# EAGLE design wordclock-ledboard (EAGLE 6.4)
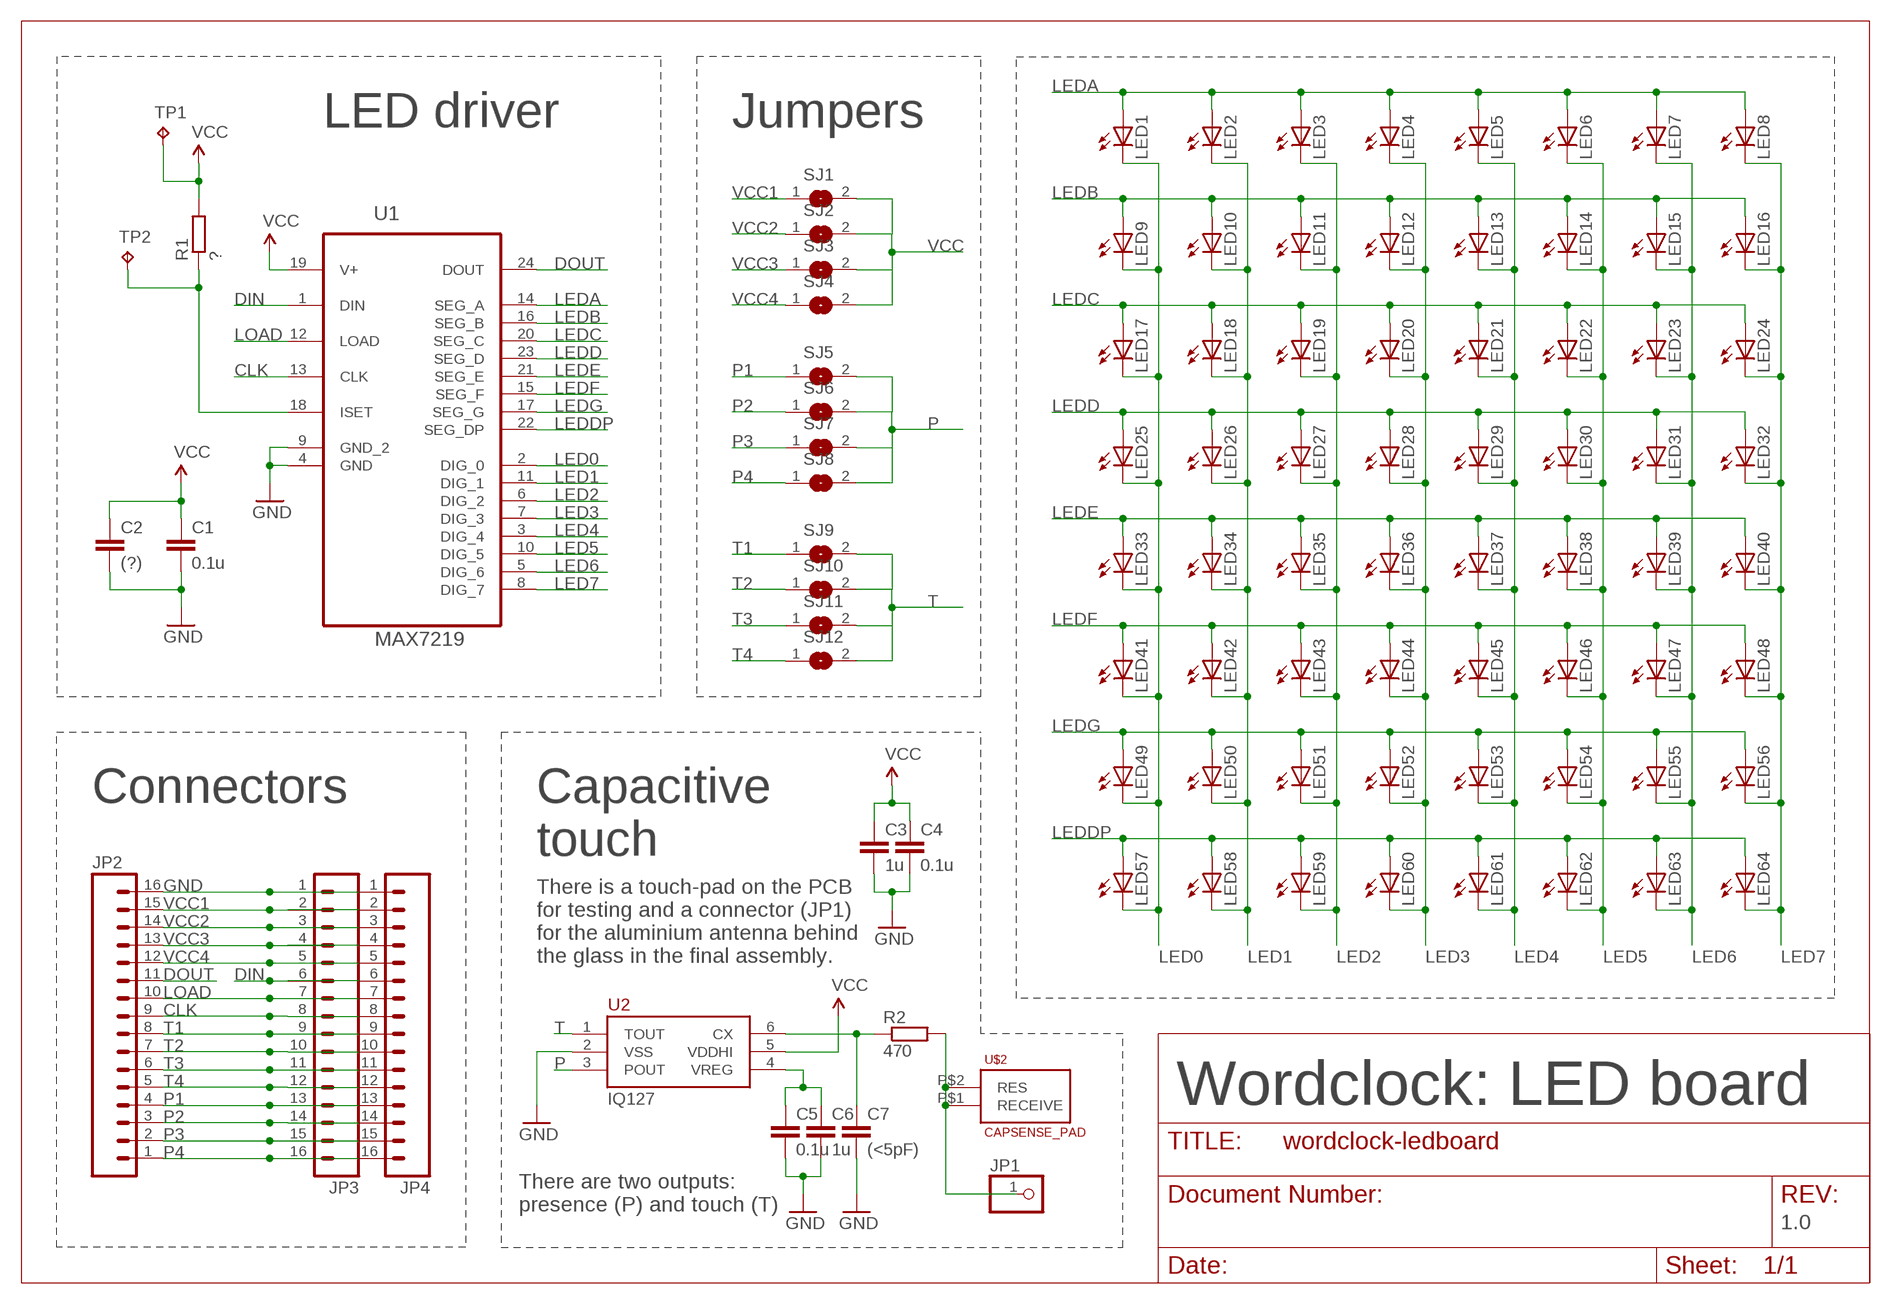
[diagram p0: schematic, sheet 1]

## Parts
C1  0.1u  C-EUC0805  [C0805]
C2  (?)  C-EUC0805  [C0805]
C3  1u  C-EUC0805  [C0805]
C4  0.1u  C-EUC0805  [C0805]
C5  0.1u  C-EUC0805  [C0805]
C6  1u  C-EUC0805  [C0805]
C7  (<5pF)  C-EUC0805  [C0805]
JP1  PINHD-1X1  [1X01]
JP2  M161X16_NO_SILK  [1X16_NO_SILK]
JP3  M161X16_NO_SILK  [1X16_NO_SILK]
JP4  M161X16_NO_SILK  [1X16_NO_SILK]
LED1  LEDKA-3528ASYC  [KA-3528ASYC]
LED2  LEDKA-3528ASYC  [KA-3528ASYC]
LED3  LEDKA-3528ASYC  [KA-3528ASYC]
LED4  LEDKA-3528ASYC  [KA-3528ASYC]
LED5  LEDKA-3528ASYC  [KA-3528ASYC]
LED6  LEDKA-3528ASYC  [KA-3528ASYC]
LED7  LEDKA-3528ASYC  [KA-3528ASYC]
LED8  LEDKA-3528ASYC  [KA-3528ASYC]
LED9  LEDKA-3528ASYC  [KA-3528ASYC]
LED10  LEDKA-3528ASYC  [KA-3528ASYC]
LED11  LEDKA-3528ASYC  [KA-3528ASYC]
LED12  LEDKA-3528ASYC  [KA-3528ASYC]
LED13  LEDKA-3528ASYC  [KA-3528ASYC]
LED14  LEDKA-3528ASYC  [KA-3528ASYC]
LED15  LEDKA-3528ASYC  [KA-3528ASYC]
LED16  LEDKA-3528ASYC  [KA-3528ASYC]
LED17  LEDKA-3528ASYC  [KA-3528ASYC]
LED18  LEDKA-3528ASYC  [KA-3528ASYC]
LED19  LEDKA-3528ASYC  [KA-3528ASYC]
LED20  LEDKA-3528ASYC  [KA-3528ASYC]
LED21  LEDKA-3528ASYC  [KA-3528ASYC]
LED22  LEDKA-3528ASYC  [KA-3528ASYC]
LED23  LEDKA-3528ASYC  [KA-3528ASYC]
LED24  LEDKA-3528ASYC  [KA-3528ASYC]
LED25  LEDKA-3528ASYC  [KA-3528ASYC]
LED26  LEDKA-3528ASYC  [KA-3528ASYC]
LED27  LEDKA-3528ASYC  [KA-3528ASYC]
LED28  LEDKA-3528ASYC  [KA-3528ASYC]
LED29  LEDKA-3528ASYC  [KA-3528ASYC]
LED30  LEDKA-3528ASYC  [KA-3528ASYC]
LED31  LEDKA-3528ASYC  [KA-3528ASYC]
LED32  LEDKA-3528ASYC  [KA-3528ASYC]
LED33  LEDKA-3528ASYC  [KA-3528ASYC]
LED34  LEDKA-3528ASYC  [KA-3528ASYC]
LED35  LEDKA-3528ASYC  [KA-3528ASYC]
LED36  LEDKA-3528ASYC  [KA-3528ASYC]
LED37  LEDKA-3528ASYC  [KA-3528ASYC]
LED38  LEDKA-3528ASYC  [KA-3528ASYC]
LED39  LEDKA-3528ASYC  [KA-3528ASYC]
LED40  LEDKA-3528ASYC  [KA-3528ASYC]
LED41  LEDKA-3528ASYC  [KA-3528ASYC]
LED42  LEDKA-3528ASYC  [KA-3528ASYC]
LED43  LEDKA-3528ASYC  [KA-3528ASYC]
LED44  LEDKA-3528ASYC  [KA-3528ASYC]
LED45  LEDKA-3528ASYC  [KA-3528ASYC]
LED46  LEDKA-3528ASYC  [KA-3528ASYC]
LED47  LEDKA-3528ASYC  [KA-3528ASYC]
LED48  LEDKA-3528ASYC  [KA-3528ASYC]
LED49  LEDKA-3528ASYC  [KA-3528ASYC]
LED50  LEDKA-3528ASYC  [KA-3528ASYC]
LED51  LEDKA-3528ASYC  [KA-3528ASYC]
LED52  LEDKA-3528ASYC  [KA-3528ASYC]
LED53  LEDKA-3528ASYC  [KA-3528ASYC]
LED54  LEDKA-3528ASYC  [KA-3528ASYC]
LED55  LEDKA-3528ASYC  [KA-3528ASYC]
LED56  LEDKA-3528ASYC  [KA-3528ASYC]
LED57  LEDKA-3528ASYC  [KA-3528ASYC]
LED58  LEDKA-3528ASYC  [KA-3528ASYC]
LED59  LEDKA-3528ASYC  [KA-3528ASYC]
LED60  LEDKA-3528ASYC  [KA-3528ASYC]
LED61  LEDKA-3528ASYC  [KA-3528ASYC]
LED62  LEDKA-3528ASYC  [KA-3528ASYC]
LED63  LEDKA-3528ASYC  [KA-3528ASYC]
LED64  LEDKA-3528ASYC  [KA-3528ASYC]
R1  ?  R-EU_R0603  [R0603]
R2  470  R-EU_R0603  [R0603]
SJ1  SJW  [SJW]
SJ2  SJW  [SJW]
SJ3  SJW  [SJW]
SJ4  SJW  [SJW]
SJ5  SJW  [SJW]
SJ6  SJW  [SJW]
SJ7  SJW  [SJW]
SJ8  SJW  [SJW]
SJ9  SJW  [SJW]
SJ10  SJW  [SJW]
SJ11  SJW  [SJW]
SJ12  SJW  [SJW]
TP1  TPTP20R  [TP20R]
TP2  TPTP20R  [TP20R]
U1  MAX7219  MAX7219CWG+T  [SOIC127P1032X265-24N]
U2  IQ127  [TSOT-23-6]
U$2  CAPSENSE_PAD  [CAPSENSE_PAD]

## Nets
C6: C5.1 C6.1 U2.4(VREG)
CLK: JP2.9 JP3.8 JP4.8 U1.13(CLK)
DIN: JP3.6 JP4.6 U1.1(DIN)
DOUT: JP2.11 U1.24(DOUT)
GND: C1.2 C2.2 C3.2 C4.2 C5.2 C6.2 C7.2 JP2.16 JP3.1 JP4.1 U1.4(GND) U1.9(GND_2) U2.2(VSS)
LED0: LED1.C LED9.C LED17.C LED25.C LED33.C LED41.C LED49.C LED57.C U1.2(DIG_0)
LED1: LED2.C LED10.C LED18.C LED26.C LED34.C LED42.C LED50.C LED58.C U1.11(DIG_1)
LED2: LED3.C LED11.C LED19.C LED27.C LED35.C LED43.C LED51.C LED59.C U1.6(DIG_2)
LED3: LED4.C LED12.C LED20.C LED28.C LED36.C LED44.C LED52.C LED60.C U1.7(DIG_3)
LED4: LED5.C LED13.C LED21.C LED29.C LED37.C LED45.C LED53.C LED61.C U1.3(DIG_4)
LED5: LED6.C LED14.C LED22.C LED30.C LED38.C LED46.C LED54.C LED62.C U1.10(DIG_5)
LED6: LED7.C LED15.C LED23.C LED31.C LED39.C LED47.C LED55.C LED63.C U1.5(DIG_6)
LED7: LED8.C LED16.C LED24.C LED32.C LED40.C LED48.C LED56.C LED64.C U1.8(DIG_7)
LEDA: LED1.A LED2.A LED3.A LED4.A LED5.A LED6.A LED7.A LED8.A U1.14(SEG_A)
LEDB: LED9.A LED10.A LED11.A LED12.A LED13.A LED14.A LED15.A LED16.A U1.16(SEG_B)
LEDC: LED17.A LED18.A LED19.A LED20.A LED21.A LED22.A LED23.A LED24.A U1.20(SEG_C)
LEDD: LED25.A LED26.A LED27.A LED28.A LED29.A LED30.A LED31.A LED32.A U1.23(SEG_D)
LEDDP: LED57.A LED58.A LED59.A LED60.A LED61.A LED62.A LED63.A LED64.A U1.22(SEG_DP)
LEDE: LED33.A LED34.A LED35.A LED36.A LED37.A LED38.A LED39.A LED40.A U1.21(SEG_E)
LEDF: LED41.A LED42.A LED43.A LED44.A LED45.A LED46.A LED47.A LED48.A U1.15(SEG_F)
LEDG: LED49.A LED50.A LED51.A LED52.A LED53.A LED54.A LED55.A LED56.A U1.17(SEG_G)
LOAD: JP2.10 JP3.7 JP4.7 U1.12(LOAD)
N$3: JP1.1 R2.2 U$2.P$1(RECEIVE) U$2.P$2(RES)
N$7: R1.1 TP2.TP U1.18(ISET)
N$13: C7.1 R2.1 U2.6(CX)
P: SJ5.2 SJ6.2 SJ7.2 SJ8.2 U2.3(POUT)
P1: JP2.4 JP3.13 JP4.13 SJ5.1
P2: JP2.3 JP3.14 JP4.14 SJ6.1
P3: JP2.2 JP3.15 JP4.15 SJ7.1
P4: JP2.1 JP3.16 JP4.16 SJ8.1
T: SJ9.2 SJ10.2 SJ11.2 SJ12.2 U2.1(TOUT)
T1: JP2.8 JP3.9 JP4.9 SJ9.1
T2: JP2.7 JP3.10 JP4.10 SJ10.1
T3: JP2.6 JP3.11 JP4.11 SJ11.1
T4: JP2.5 JP3.12 JP4.12 SJ12.1
VCC: C1.1 C2.1 C3.1 C4.1 R1.2 SJ1.2 SJ2.2 SJ3.2 SJ4.2 TP1.TP U1.19(V+) U2.5(VDDHI)
VCC1: JP2.15 JP3.2 JP4.2 SJ1.1
VCC2: JP2.14 JP3.3 JP4.3 SJ2.1
VCC3: JP2.13 JP3.4 JP4.4 SJ3.1
VCC4: JP2.12 JP3.5 JP4.5 SJ4.1

## Notes on the sheet
- LED driver | Jumpers
- Connectors
- Capacitive
  touch
- There is a touch-pad on the PCB 
  for testing and a connector (JP1) 
  for the aluminium antenna behind 
  the glass in the final assembly.
- IQ127 | Wordclock: LED board
- There are two outputs: 
  presence (P) and touch (T)
- 1.0

## Library data of the parts
C1-C7 = rcl:C-EU: CAPACITOR, European symbol
JP1 = pinhead:PINHD-1X1: PIN HEADER
JP2-JP4 = SparkFun-Connectors:M16: 1x16 .1" header
LED1-LED64 = led:LED: LED OSRAM: - CHIPLED LG R971, LG N971, LY N971, LG Q971, LY Q971, LO R971, LY R971 LH N974, LH R974 LS Q976, LO Q976, LY Q976 LO Q996 - Hyper CHIPLED LW Q18S LB Q993, LB Q99A, LB R99A - SideLED LS A670, LO A670, LY A670, LG A670, LP A670 LB A673, LV A673, LT A673, LW A673 LH A674 LY A675 LS A676, LA A676, LO A676, LY A676, LW A676 LS A679, LY A679, LG A679 - Hyper Micro SIDELED® LS Y876, LA Y876, LO Y876, LY Y876 LT Y87S - SmartLED LW L88C, LW L88S LB L89C, LB L89S, LG L890 LS L89K, LO L89K, LY L89K LS L896, LA L896, LO L896, LY L896 - TOPLED LS T670, LO T670, LY T670, LG T670, LP T670 LSG T670, LSP T670, LSY T670, LOP T670, LYG T670 LG T671, LOG T671, LSG T671 LB T673, LV T673, LT T673, LW T673 LH T674 LS T676, LA T676, LO T676, LY T676, LB T676, LH T676, LSB T676, LW T676 LB T67C, LV T67C, LT T67C, LS T67K, LO T67K, LY T67K, LW E67C LS E67B, LA E67B, LO E67B, LY E67B, LB E67C, LV E67C, LT E67C LW T67C LS T679, LY T679, LG T679 LS T770, LO T770, LY T770, LG T770, LP T770 LB T773, LV T773, LT T773, LW T773 LH T774 LS E675, LA E675, LY E675, LS T675 LS T776, LA T776, LO T776, LY T776, LB T776 LHGB T686 LT T68C, LB T68C - Hyper Mini TOPLED® LB M676 - Mini TOPLED Santana® LG M470 LS M47K, LO M47K, LY M47K Source: http://www.osram.convergy.de LUXEON: - LUMILED® LXK2-PW12-R00, LXK2-PW12-S00, LXK2-PW14-U00, LXK2-PW14-V00 LXK2-PM12-R00, LXK2-PM12-S00, LXK2-PM14-U00 LXK2-PE12-Q00, LXK2-PE12-R00, LXK2-PE12-S00, LXK2-PE14-T00, LXK2-PE14-U00 LXK2-PB12-K00, LXK2-PB12-L00, LXK2-PB12-M00, LXK2-PB14-N00, LXK2-PB14-P00, LXK2-PB14-Q00 LXK2-PR12-L00, LXK2-PR12-M00, LXK2-PR14-Q00, LXK2-PR14-R00 LXK2-PD12-Q00, LXK2-PD12-R00, LXK2-PD12-S00 LXK2-PH12-R00, LXK2-PH12-S00 LXK2-PL12-P00, LXK2-PL12-Q00, LXK2-PL12-R00 Source: www.luxeon.com KINGBRIGHT: KA-3528ASYC Source: www.kingbright.com
R1 R2 = rcl:R-EU_: RESISTOR, European symbol
SJ1-SJ12 = jumper:SJ: SMD solder JUMPER
TP1 TP2 = testpad:TP: Test pad
U1 = Max7219Cwg:MAX7219CWG+T; DESCRIPTION: Serially Interfaced, 8-Digit LED Display Drivers; MPN: MAX7219CWG+T; OC_FARNELL: -; OC_NEWARK: 68K9462; PACKAGE: SOIC-24; SUPPLIER: Maxim
U2 = Wouter-Azoteq:IQ127
U$2 = SparkFun-Electromechanical:CAPSENSE_PAD: Generic copper pad for a capacitive touch sensor.

## Board
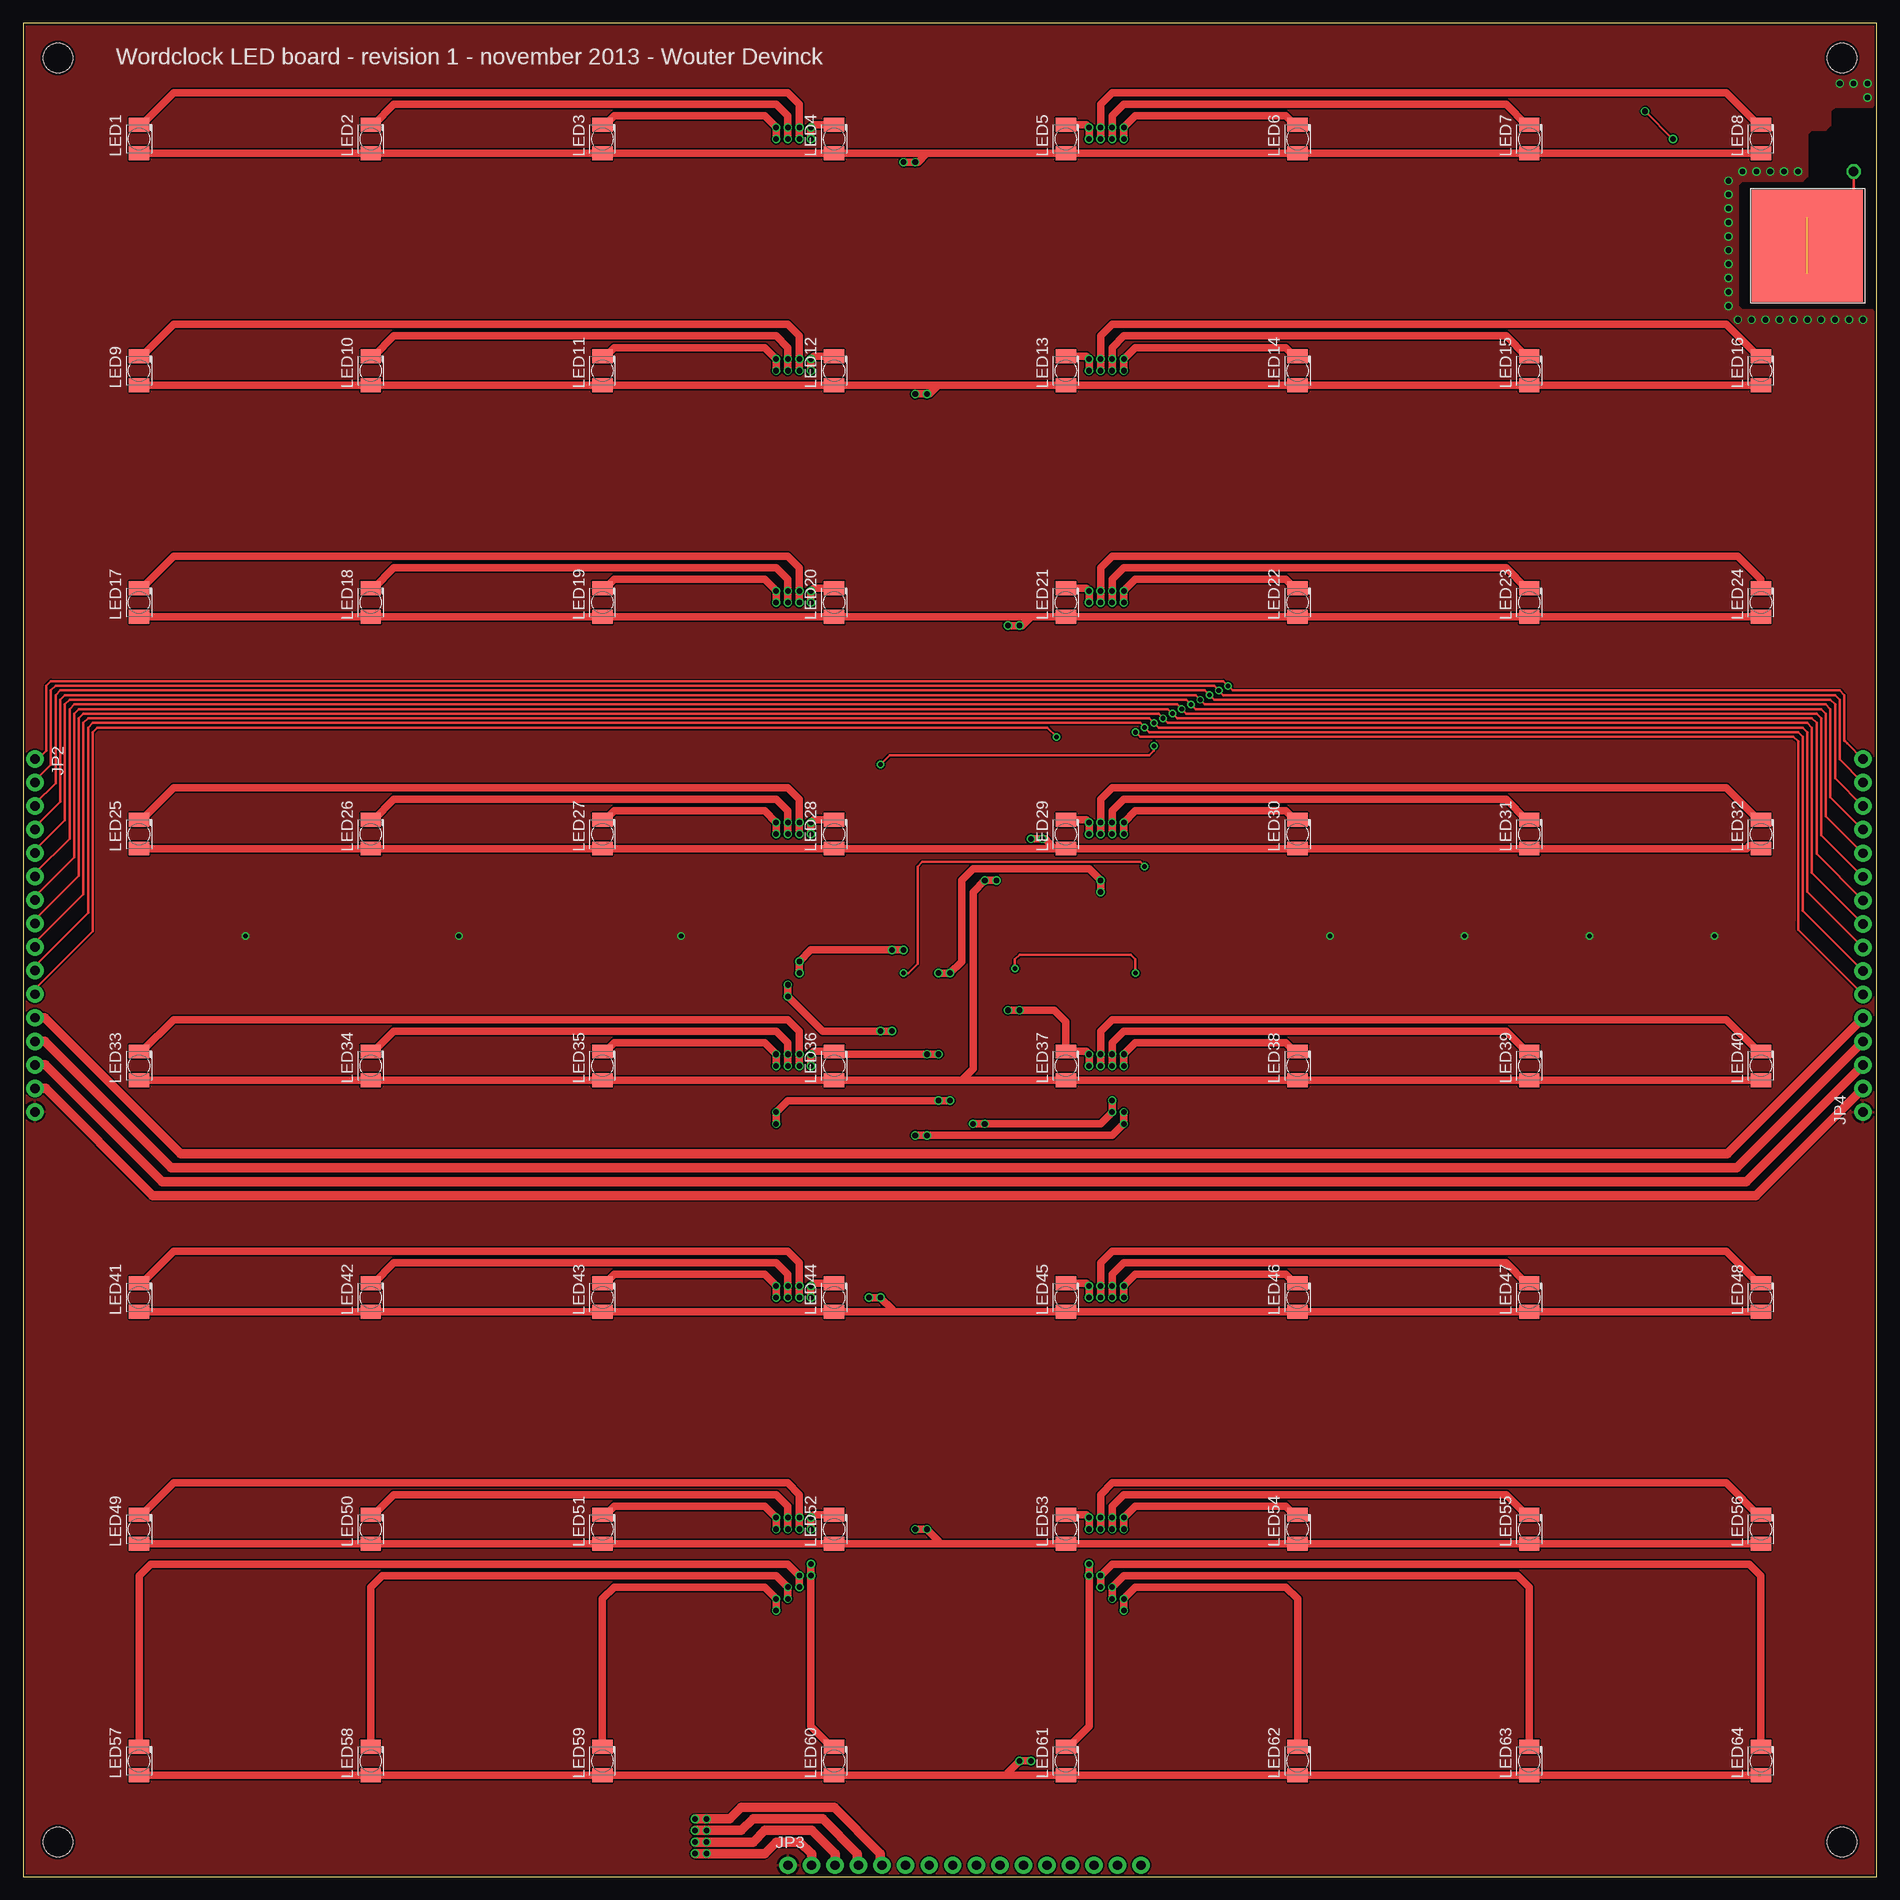
[diagram p1: board, top side]
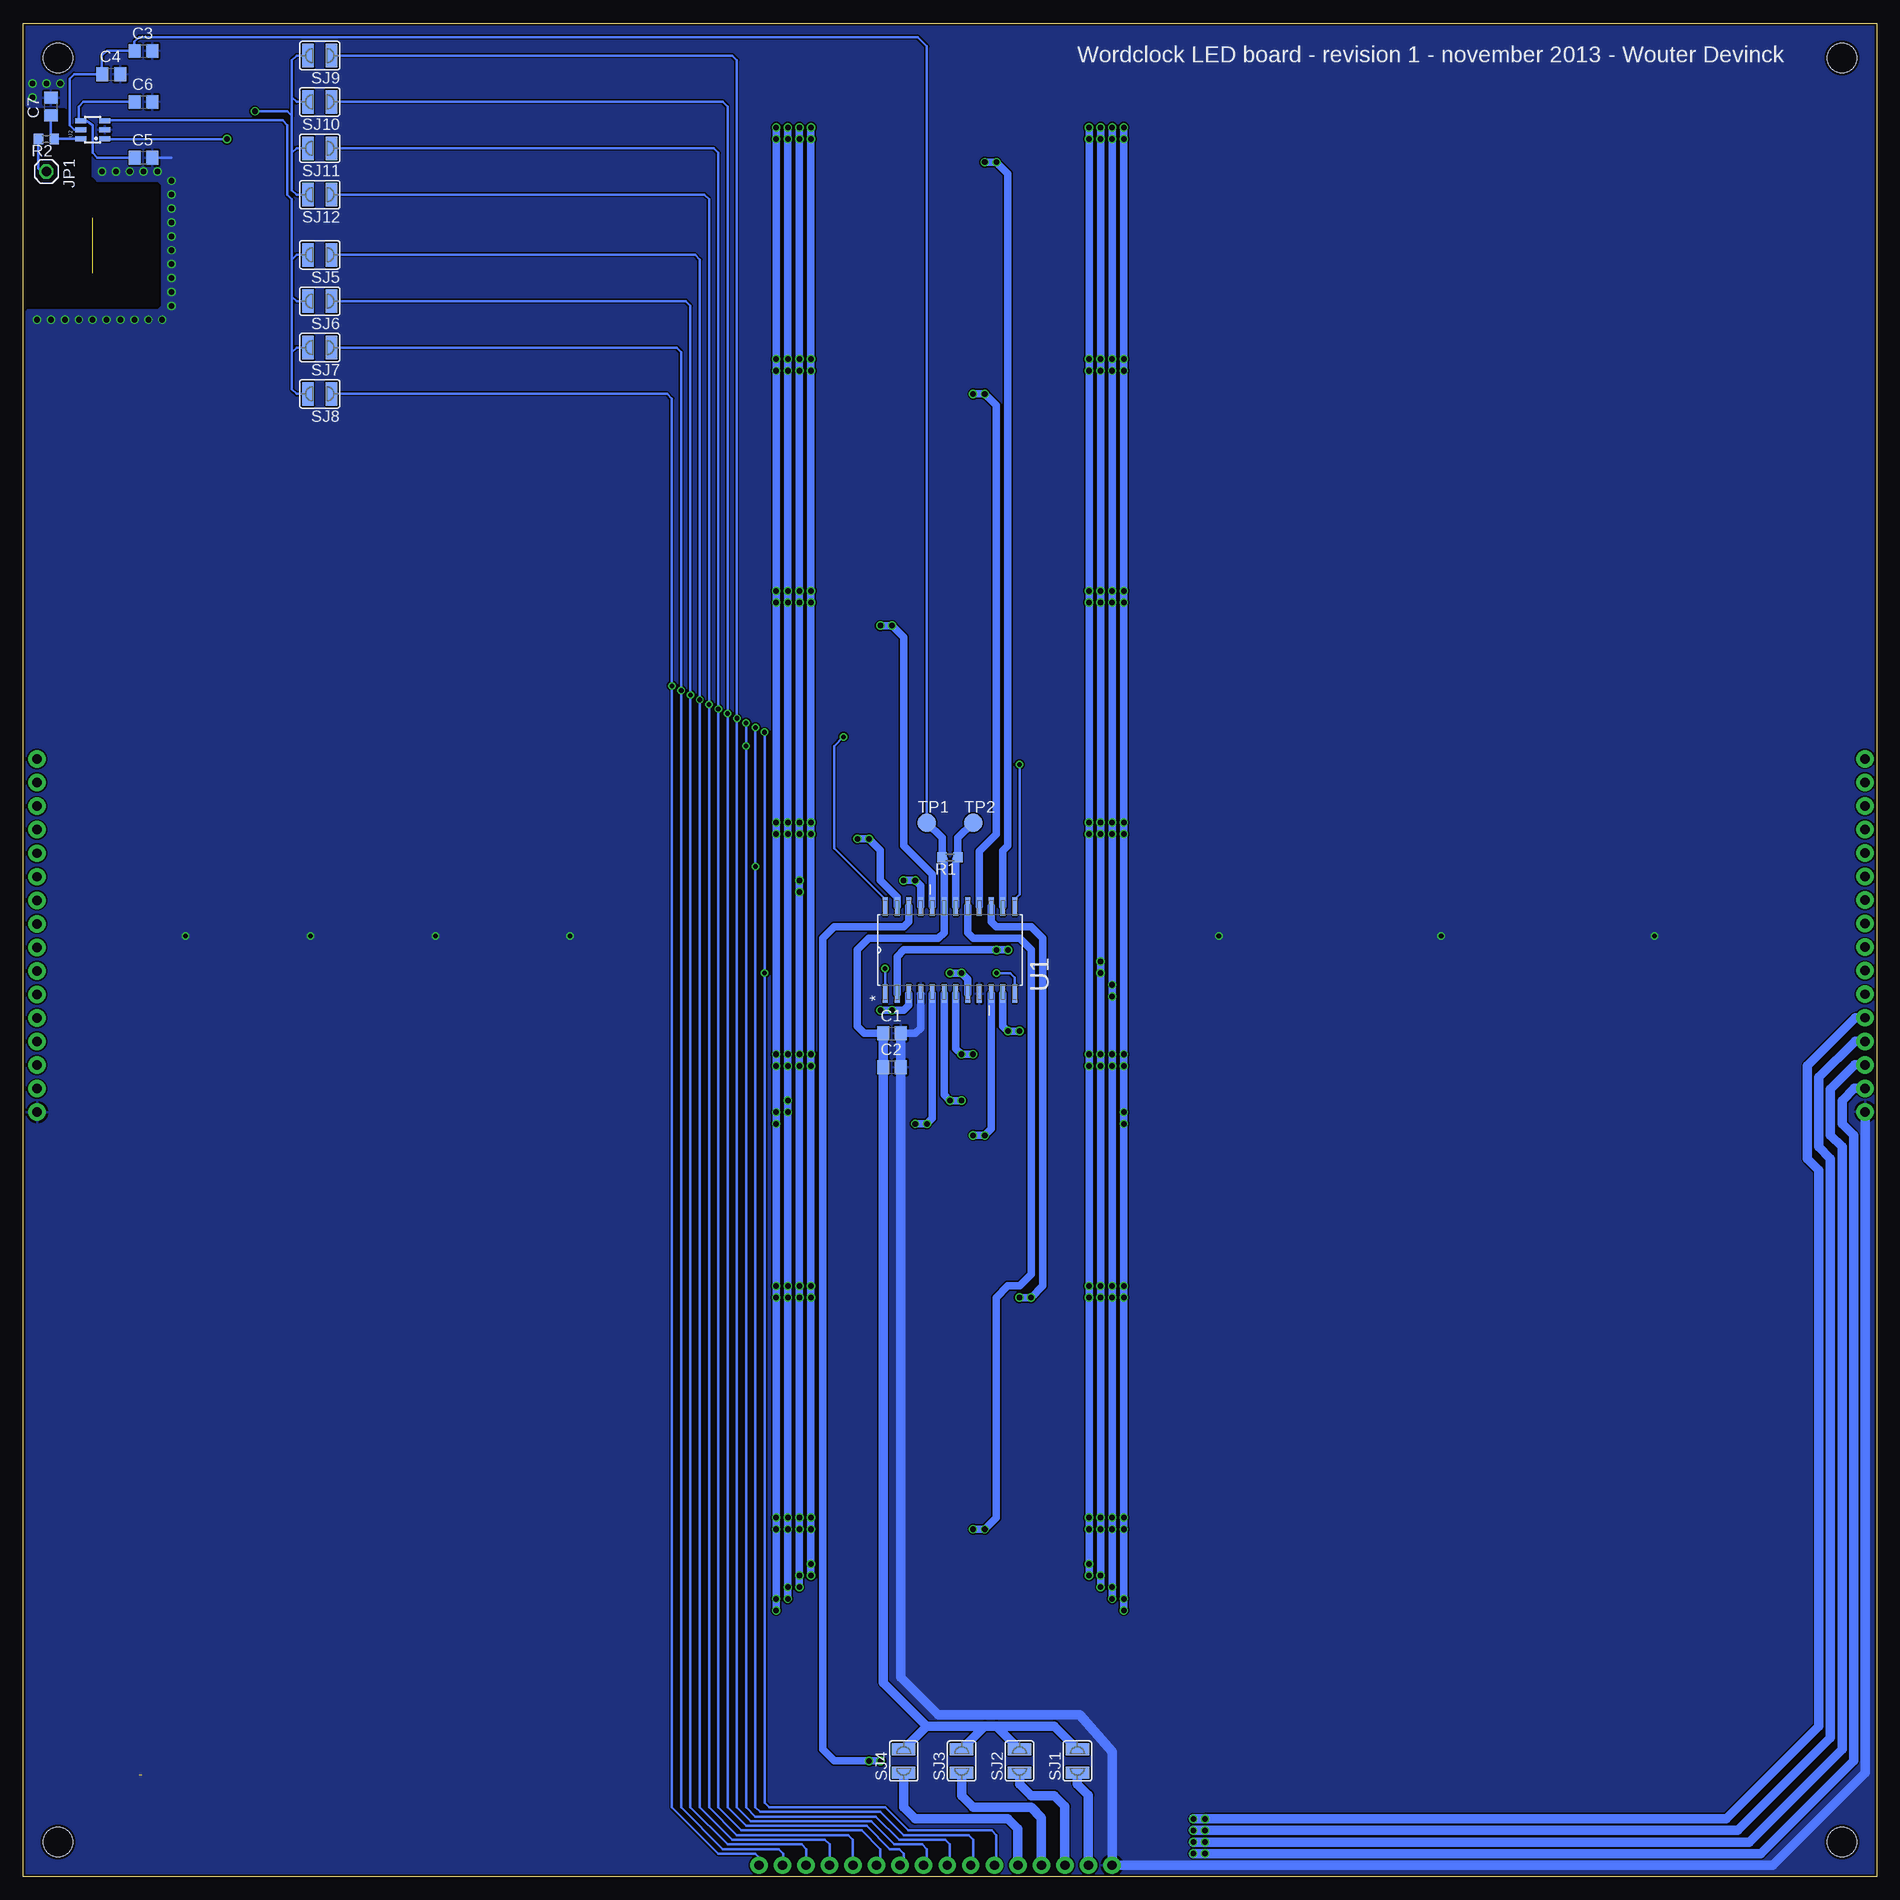
[diagram p2: board, bottom side, seen from below]

Size 200 x 200 mm. Coordinates in mm from the lower left corner, seen from the top.
Outline: 0,0 200,0 200,200 0,200 0,0
Copper layers (1*2*15*16): Top 0.035mm / dielectric 0.2mm / Route2 0.0175mm / dielectric 1.1mm / Route15 0.0175mm / dielectric 0.2mm / Bottom 0.035mm
Design rules "SeeedStudio_DRU_no_angle_20130527": minimum track width 6mil, minimum drill 12mil, track to track 6mil, track to pad 6mil, pad to pad 6mil, via to via 6mil, smd to smd 0mil, copper to edge 10mil, drill to drill 10mil, minimum pad ring 6mil, minimum via ring 6mil, stop-mask expansion 2mil, vias tented up to drill 25mil, thermal gap 10mil
Holes 3.2 mm at 3.75,196.25 196.25,196.25 196.25,3.75 3.75,3.75

### Footprints (pad centres in the part's own frame; a part is rotated, then mirrored left to right if it is on the bottom)
C0805 = smd 1.3 x 1.5: 1 -0.95,0; 2 0.95,0
1X01 = drill 1.016 octagon: 1 0,0
1X16_NO_SILK = drill 1.016 pad 1.88: 1 0,0; 2 2.54,0; 3 5.08,0; 4 7.62,0; 5 10.16,0; 6 12.7,0; 7 15.24,0; 8 17.78,0; 9 20.32,0; 10 22.86,0; 11 25.4,0; 12 27.94,0; 13 30.48,0; 14 33.02,0; 15 35.56,0; 16 38.1,0
KA-3528ASYC = smd 1.5 x 2.2: A -1.55,0; C 1.55,0
R0603 = smd 1 x 1.1: 1 -0.85,0; 2 0.85,0
SJW = smd 1.27 x 2.54: 1 -1.27,0; 2 1.27,0
TP20R = smd 2 x 2: TP 0,0
SOIC127P1032X265-24N = smd 1.981 x 0.533: 1 -4.699,6.985; 2 -4.699,5.715; 3 -4.699,4.445; 4 -4.699,3.175; 5 -4.699,1.905; 6 -4.699,0.635; 7 -4.699,-0.635; 8 -4.699,-1.905; 9 -4.699,-3.175; 10 -4.699,-4.445; 11 -4.699,-5.715; 12 -4.699,-6.985; 13 4.699,-6.985; 14 4.699,-5.715; 15 4.699,-4.445; 16 4.699,-3.175; 17 4.699,-1.905; 18 4.699,-0.635; 19 4.699,0.635; 20 4.699,1.905; 21 4.699,3.175; 22 4.699,4.445; 23 4.699,5.715; 24 4.699,6.985
TSOT-23-6 = smd 0.55 x 1.2: 1 -0.95,-1.3; 2 0,-1.3; 3 0.95,-1.3; 4 0.95,1.3; 5 0,1.3; 6 -0.95,1.3
CAPSENSE_PAD = smd 12 x 6.1: P$1 0,3; P$2 0,-3

### Placement (x,y rotation side)
C1  106.25,91 0 bottom
C2  106.25,87.37 0 bottom
C3  187,197 0 bottom
C4  190.5,194.5 0 bottom
C5  187,185.5 0 bottom
C6  187,191.5 0 bottom
C7  197,191 90 bottom
JP1  197.5,184 270 bottom
JP2  1.27,120.63 270 top
JP3  82.52,1.25 0 top
JP4  198.5,82.5 90 top
LED1  12.5,187.5 90 top
LED2  37.5,187.5 90 top
LED3  62.5,187.5 90 top
LED4  87.5,187.5 90 top
LED5  112.5,187.5 90 top
LED6  137.5,187.5 90 top
LED7  162.5,187.5 90 top
LED8  187.5,187.5 90 top
LED9  12.5,162.5 90 top
LED10  37.5,162.5 90 top
LED11  62.5,162.5 90 top
LED12  87.5,162.5 90 top
LED13  112.5,162.5 90 top
LED14  137.5,162.5 90 top
LED15  162.5,162.5 90 top
LED16  187.5,162.5 90 top
LED17  12.5,137.5 90 top
LED18  37.5,137.5 90 top
LED19  62.5,137.5 90 top
LED20  87.5,137.5 90 top
LED21  112.5,137.5 90 top
LED22  137.5,137.5 90 top
LED23  162.5,137.5 90 top
LED24  187.5,137.5 90 top
LED25  12.5,112.5 90 top
LED26  37.5,112.5 90 top
LED27  62.5,112.5 90 top
LED28  87.5,112.5 90 top
LED29  112.5,112.5 90 top
LED30  137.5,112.5 90 top
LED31  162.5,112.5 90 top
LED32  187.5,112.5 90 top
LED33  12.5,87.5 90 top
LED34  37.5,87.5 90 top
LED35  62.5,87.5 90 top
LED36  87.5,87.5 90 top
LED37  112.5,87.5 90 top
LED38  137.5,87.5 90 top
LED39  162.5,87.5 90 top
LED40  187.5,87.5 90 top
LED41  12.5,62.5 90 top
LED42  37.5,62.5 90 top
LED43  62.5,62.5 90 top
LED44  87.5,62.5 90 top
LED45  112.5,62.5 90 top
LED46  137.5,62.5 90 top
LED47  162.5,62.5 90 top
LED48  187.5,62.5 90 top
LED49  12.5,37.5 90 top
LED50  37.5,37.5 90 top
LED51  62.5,37.5 90 top
LED52  87.5,37.5 90 top
LED53  112.5,37.5 90 top
LED54  137.5,37.5 90 top
LED55  162.5,37.5 90 top
LED56  187.5,37.5 90 top
LED57  12.5,12.5 90 top
LED58  37.5,12.5 90 top
LED59  62.5,12.5 90 top
LED60  87.5,12.5 90 top
LED61  112.5,12.5 90 top
LED62  137.5,12.5 90 top
LED63  162.5,12.5 90 top
LED64  187.5,12.5 90 top
R1  100,110 180 bottom
R2  197.5,187.5 180 bottom
SJ1  86.25,12.5 90 bottom
SJ2  92.5,12.5 90 bottom
SJ3  98.75,12.5 90 bottom
SJ4  105,12.5 90 bottom
SJ5  168,175 180 bottom
SJ6  168,170 180 bottom
SJ7  168,165 180 bottom
SJ8  168,160 180 bottom
SJ9  168,196.5 180 bottom
SJ10  168,191.5 180 bottom
SJ11  168,186.5 180 bottom
SJ12  168,181.5 180 bottom
TP1  102.5,113.75 0 bottom
TP2  97.5,113.75 0 bottom
U1  100,100 90 bottom
U2  192.5,188.5 90 bottom
U$2  192.5,176 0 top

### Tracks (layer width: path | path; a pad name or v marks a point on that pad's centre or on a via)
C6
  Bottom 0.254: C6.1 193.5,191.5 194,191 194,189.65 U2.4 193.25,189.5 192.5,189 192.5,186 192,185.5 C5.1
CLK  (via drill 0.5)
  Top 0.254: JP2.9 1.27,100.77 6.5,106 6.5,124.5 7,125 121.5,125 v122,124.5 122.5,124 192,124 192.5,123.5 192.5,106.28 JP4.8 | v92.5,120 93.5,121 121.5,121 122,121.5 v122,122
  Bottom 0.254: JP3.8 100,1.55 100,3.5 100.5,4 105.5,4 108,6.5 121,6.5 122,7.5 v122,122 v122,124.5 | U1.13 93.02,105.48 92.5,106 v92.5,120
DIN  (via drill 0.5)
  Top 0.254: v107,98 107,99 107.5,99.5 119.5,99.5 120,99 v120,97.5 | v120,123.5 120.5,123 191,123 191.5,122.5 191.5,103 191.5,102.5 191.5,102.2 JP4.6
  Bottom 0.254: U1.1 106.98,97.98 v107,98 | JP3.6 95,1.47 95,4.5 95.5,5 104.5,5 107,7.5 119.5,7.5 120,8 v120,97.5 v120,123.5
DOUT  (via drill 0.5)
  Top 0.254: JP2.11 1.27,95.77 7.5,102 7.5,123.5 8,124 110.5,124 v111.5,123
  Bottom 0.254: U1.24 106.98,105.48 112.5,111 112.5,122 v111.5,123
GND  (via drill 0.5, 0.6)
  Bottom 0.254: C2.2 105.3,88.5 | 105.3,88.5 | C5.2 184,185.5
  Bottom 0.813: U1.4 103.17,91.58 103.75,91 105,91
  Bottom 1.016: JP2.16 1.27,81.27 1.25,81.25 1.25,11.25 11.25,1.25 JP3.1 82.52,13.52 86,17.5 101.25,17.5 105.3,21.55 105.3,88.5 C1.2 105,91
  other vias: 196,193.5 190,184 191.5,184 197.5,193.5 188.5,184 187,184 185.5,184 184,183 184,181.5 184,180 184,178.5 184,177 184,175.5 184,174 184,172.5 184,171 184,169.5 185,168 186.5,168 188,168 189.5,168 191,168 192.5,168 194,168 195.5,168 197,168 198.5,168 199,192 199,193.5 24,101.5 47,101.5 71,101.5 141,101.5 155.5,101.5 169,101.5 182.5,101.5
  pour Top: 199.5,200 200,199.5 200,191.5 199.5,191 195.5,191 195,190.5 195,189 194.5,188.5 193,188.5 192.5,188 192.5,183.5 192,183 185.5,183 185,182.5 185,169.5 185.5,169 199.5,169 200,168.5 200,0.5 199.5,0 0.5,0 0,0.5 0,199.5 0.5,200
  pour Bottom: 199.5,200 200,199.5 200,191.5 199.5,191 195.5,191 195,190.5 195,189 194.5,188.5 193,188.5 192.5,188 192.5,183.5 192,183 185.5,183 185,182.5 185,169.5 185.5,169 199.5,169 200,168.5 200,0.5 199.5,0 0.5,0 0,0.5 0,199.5 0.5,200
LED0  (via drill 0.6)
  Top 0.813: 12.2,164.05 LED9.C 12.8,164.05 16.25,167.5 82.5,167.5 83.75,166.25 v83.75,163.75 v83.75,162.5 | LED1.C 12.8,189.05 16.25,192.5 82.5,192.5 83.75,191.25 v83.75,188.75 v83.75,187.5 | LED57.C 12.5,32.5 13.75,33.75 82.5,33.75 v83.75,32.5 v83.75,31.25 | LED17.C 12.8,139.05 16.25,142.5 82.5,142.5 83.75,141.25 v83.75,138.75 v83.75,137.5 | LED25.C 12.8,114.05 16.25,117.5 82.5,117.5 83.75,116.25 v83.75,113.75 v83.75,112.5 | LED33.C 12.8,89.05 16.25,92.5 82.5,92.5 83.75,91.25 v83.75,88.75 v83.75,87.5 | LED41.C 12.8,64.05 16.25,67.5 82.5,67.5 83.75,66.25 v83.75,63.75 v83.75,62.5 | LED49.C 12.8,39.05 16.25,42.5 82.5,42.5 83.75,41.25 v83.75,38.75 v83.75,37.5 | v95,100 v93.75,100 85,100 v83.75,98.75 v83.75,97.5
  Bottom 0.813: v83.75,188.75 v83.75,187.5 v83.75,163.75 v83.75,162.5 v83.75,138.75 v83.75,137.5 v83.75,113.75 v83.75,112.5 v83.75,98.75 v83.75,97.5 v83.75,88.75 v83.75,87.5 v83.75,63.75 v83.75,62.5 v83.75,38.75 v83.75,37.5 v83.75,32.5 v83.75,31.25 | U1.2 105.72,99.28 105,100 v95,100 v93.75,100
LED1  (via drill 0.6)
  Top 0.813: 37.5,113.75 LED26.C 37.8,114.05 40,116.25 81.25,116.25 82.5,115 v82.5,113.75 v82.5,112.5 | LED2.C 37.8,189.05 40,191.25 81.25,191.25 82.5,190 v82.5,188.75 v82.5,187.5 | LED58.C 37.5,31.25 38.75,32.5 81.25,32.5 v82.5,31.25 v82.5,30 | LED10.C 37.8,164.05 40,166.25 81.25,166.25 82.5,165 v82.5,163.75 v82.5,162.5 | LED18.C 37.8,139.05 40,141.25 81.25,141.25 82.5,140 v82.5,138.75 v82.5,137.5 | LED34.C 37.8,89.05 40,91.25 81.25,91.25 82.5,90 v82.5,88.75 v82.5,87.5 | LED42.C 37.8,64.05 40,66.25 81.25,66.25 82.5,65 v82.5,63.75 v82.5,62.5 | LED50.C 37.8,39.05 40,41.25 81.25,41.25 82.5,40 v82.5,38.75 v82.5,37.5 | v93.75,91.25 v92.5,91.25 86.25,91.25 v82.5,95 v82.5,96.25
  Bottom 0.813: v82.5,30 v82.5,31.25 v82.5,37.5 v82.5,38.75 v82.5,62.5 v82.5,63.75 v82.5,87.5 v82.5,88.75 v82.5,95 v82.5,96.25 v82.5,112.5 v82.5,113.75 v82.5,137.5 v82.5,138.75 v82.5,162.5 v82.5,163.75 v82.5,187.5 v82.5,188.75 | U1.11 94.28,91.78 v93.75,91.25 v92.5,91.25
LED2  (via drill 0.6)
  Top 0.813: LED3.C 62.8,189.05 63.75,190 80,190 v81.25,188.75 v81.25,187.5 | LED59.C 62.5,30 63.75,31.25 80,31.25 v81.25,30 v81.25,28.75 | LED11.C 62.8,164.05 63.75,165 80,165 v81.25,163.75 v81.25,162.5 | LED19.C 62.8,139.05 63.75,140 80,140 v81.25,138.75 v81.25,137.5 | LED27.C 62.8,114.05 63.75,115 80,115 v81.25,113.75 v81.25,112.5 | LED35.C 62.8,89.05 63.75,90 80,90 v81.25,88.75 v81.25,87.5 | LED43.C 62.8,64.05 63.75,65 80,65 v81.25,63.75 v81.25,62.5 | LED51.C 62.8,39.05 63.75,40 80,40 v81.25,38.75 v81.25,37.5 | v100,83.75 v98.75,83.75 82.5,83.75 v81.25,82.5 v81.25,81.25
  Bottom 0.813: v81.25,188.75 v81.25,187.5 v81.25,163.75 v81.25,162.5 v81.25,138.75 v81.25,137.5 v81.25,113.75 v81.25,112.5 v81.25,88.75 v81.25,87.5 v81.25,82.5 v81.25,81.25 v81.25,63.75 v81.25,62.5 v81.25,38.75 v81.25,37.5 v81.25,30 v81.25,28.75 | U1.6 100.64,84.39 v100,83.75 v98.75,83.75
LED3  (via drill 0.6)
  Top 0.813: LED4.C 85.3,189.05 v85,188.75 v85,187.5 | LED60.C 87.2,14.05 85,16.25 v85,32.5 v85,33.75 | LED12.C 85.3,164.05 v85,163.75 v85,162.5 | LED20.C 85.3,139.05 v85,138.75 v85,137.5 | LED28.C 85.3,114.05 v85,113.75 v85,112.5 | v85,87.5 v85,88.75 85.3,89.05 LED36.C 87.8,88.75 v98.75,88.75 v97.5,88.75 | LED44.C 85.3,64.05 v85,63.75 v85,62.5 | LED52.C 85.3,39.05 v85,38.75 v85,37.5
  Bottom 0.813: v85,188.75 v85,187.5 v85,163.75 v85,162.5 v85,138.75 v85,137.5 v85,113.75 v85,112.5 v85,88.75 v85,87.5 v85,63.75 v85,62.5 v85,38.75 v85,37.5 v85,33.75 v85,32.5 | U1.7 99.36,89.36 v98.75,88.75 v97.5,88.75
LED4  (via drill 0.6)
  Top 0.813: 112.2,139.05 LED21.C 114.7,139.05 v115,138.75 v115,137.5 | LED5.C 114.7,189.05 v115,188.75 v115,187.5 | LED13.C 114.7,164.05 v115,163.75 v115,162.5 | LED29.C 114.7,114.05 v115,113.75 v115,112.5 | v115,87.5 v115,88.75 114.7,89.05 LED37.C 112.5,92.25 111.25,93.5 v106.25,93.5 v107.5,93.5 | LED45.C 114.7,64.05 v115,63.75 v115,62.5 | LED53.C 114.7,39.05 v115,38.75 v115,37.5 | LED61.C 112.8,14.05 115,16.25 v115,32.5 v115,33.75
  Bottom 0.813: v115,188.75 v115,187.5 v115,163.75 v115,162.5 v115,138.75 v115,137.5 v115,113.75 v115,112.5 v115,88.75 v115,87.5 v115,63.75 v115,62.5 v115,38.75 v115,37.5 v115,33.75 v115,32.5 | U1.3 104.44,94.06 105,93.5 v106.25,93.5 v107.5,93.5
LED5  (via drill 0.6)
  Top 0.813: LED6.C 137.2,189.05 136.25,190 120,190 v118.75,188.75 v118.75,187.5 | LED14.C 137.2,164.05 136.25,165 120,165 v118.75,163.75 v118.75,162.5 | LED22.C 137.2,139.05 136.25,140 120,140 v118.75,138.75 v118.75,137.5 | LED30.C 137.2,114.05 136.25,115 120,115 v118.75,113.75 v118.75,112.5 | LED38.C 137.2,89.05 136.25,90 120,90 v118.75,88.75 v118.75,87.5 | LED46.C 137.2,64.05 136.25,65 120,65 v118.75,63.75 v118.75,62.5 | LED54.C 137.2,39.05 136.25,40 120,40 v118.75,38.75 v118.75,37.5 | LED62.C 137.5,30 136.25,31.25 120,31.25 v118.75,30 v118.75,28.75 | v96.25,80 v97.5,80 117.5,80 v118.75,81.25 v118.75,82.5
  Bottom 0.813: v118.75,28.75 v118.75,30 v118.75,37.5 v118.75,38.75 v118.75,62.5 v118.75,63.75 v118.75,81.25 v118.75,82.5 v118.75,87.5 v118.75,88.75 v118.75,112.5 v118.75,113.75 v118.75,137.5 v118.75,138.75 v118.75,162.5 v118.75,163.75 v118.75,187.5 v118.75,188.75 | v97.5,80 v96.25,80 95.56,80.69 U1.10
LED6  (via drill 0.6)
  Top 0.813: LED7.C 162.2,189.05 160,191.25 118.75,191.25 117.5,190 v117.5,188.75 v117.5,187.5 | LED15.C 162.2,164.05 160,166.25 118.75,166.25 117.5,165 v117.5,163.75 v117.5,162.5 | LED23.C 162.2,139.05 160,141.25 118.75,141.25 117.5,140 v117.5,138.75 v117.5,137.5 | LED31.C 162.2,114.05 160,116.25 118.75,116.25 117.5,115 v117.5,113.75 v117.5,112.5 | LED39.C 162.2,89.05 160,91.25 118.75,91.25 117.5,90 v117.5,88.75 v117.5,87.5 | LED47.C 162.2,64.05 160,66.25 118.75,66.25 117.5,65 v117.5,63.75 v117.5,62.5 | LED55.C 162.2,39.05 160,41.25 118.75,41.25 117.5,40 v117.5,38.75 v117.5,37.5 | LED63.C 162.5,31.25 161.25,32.5 118.75,32.5 v117.5,31.25 v117.5,30 | v102.5,81.25 v103.75,81.25 116.25,81.25 v117.5,82.5 v117.5,83.75
  Bottom 0.813: v117.5,188.75 v117.5,187.5 v117.5,163.75 v117.5,162.5 v117.5,138.75 v117.5,137.5 v117.5,113.75 v117.5,112.5 v117.5,88.75 v117.5,87.5 v117.5,83.75 v117.5,82.5 v117.5,63.75 v117.5,62.5 v117.5,38.75 v117.5,37.5 v117.5,31.25 v117.5,30 | U1.5 101.91,81.84 v102.5,81.25 v103.75,81.25
LED7  (via drill 0.6)
  Top 0.813: 187.8,189.05 LED8.C 187.2,189.05 183.75,192.5 117.5,192.5 116.25,191.25 v116.25,188.75 v116.25,187.5 | LED16.C 187.2,164.05 183.75,167.5 117.5,167.5 116.25,166.25 v116.25,163.75 v116.25,162.5 | LED24.C 187.5,140 185,142.5 117.5,142.5 116.25,141.25 v116.25,138.75 v116.25,137.5 | LED32.C 187.2,114.05 183.75,117.5 117.5,117.5 116.25,116.25 v116.25,113.75 v116.25,112.5 | LED40.C 187.2,89.05 183.75,92.5 117.5,92.5 116.25,91.25 v116.25,88.75 v116.25,87.5 | LED48.C 187.2,64.05 183.75,67.5 117.5,67.5 116.25,66.25 v116.25,63.75 v116.25,62.5 | LED56.C 187.5,38.75 183.75,42.5 117.5,42.5 116.25,41.25 v116.25,38.75 v116.25,37.5 | LED64.C 187.5,32.5 186.25,33.75 117.5,33.75 v116.25,32.5 v116.25,31.25 | v98.75,97.5 v100,97.5 101.25,98.75 101.25,107.5 102.5,108.75 115,108.75 v116.25,107.5 v116.25,106.25
  Bottom 0.813: v116.25,31.25 v116.25,32.5 v116.25,37.5 v116.25,38.75 v116.25,62.5 v116.25,63.75 v116.25,87.5 v116.25,88.75 v116.25,106.25 v116.25,107.5 v116.25,112.5 v116.25,113.75 v116.25,137.5 v116.25,138.75 v116.25,162.5 v116.25,163.75 v116.25,187.5 v116.25,188.75 | U1.8 98.09,96.84 v98.75,97.5 v100,97.5
LEDA  (via drill 0.6)
  Top 0.813: LED1.A LED2.A LED3.A LED4.A 97.5,185.95 | 97.5,185.95 LED5.A LED6.A LED7.A LED8.A | v95,185 v96.25,185 96.55,185 97.5,185.95
  Bottom 0.813: U1.14 94.28,110.72 93.75,111.25 93.75,183.75 v95,185 v96.25,185
LEDB  (via drill 0.6)
  Top 0.813: LED9.A LED10.A LED11.A LED12.A 98.75,160.95 | LED16.A LED15.A LED14.A LED13.A 98.75,160.95 | v96.25,160 v97.5,160 97.8,160 98.75,160.95
  Bottom 0.813: U1.16 96.83,110.67 95,112.5 95,158.75 v96.25,160 v97.5,160
LEDC  (via drill 0.6)
  Top 0.813: LED17.A LED18.A LED19.A LED20.A 108.75,135.95 | LED24.A LED23.A LED22.A LED21.A 108.75,135.95 | v106.25,135 v107.5,135 107.8,135 108.75,135.95
  Bottom 0.813: U1.20 101.91,108.16 105,111.25 105,133.75 v106.25,135 v107.5,135
LEDD  (via drill 0.6)
  Top 0.813: LED25.A LED26.A LED27.A LED28.A 111.25,110.95 | 111.25,110.95 LED29.A LED30.A LED31.A 185.95,110.95 186.25,111.25 187.2,111.25 LED32.A | v108.75,112 v110,112 110.3,112 111.25,110.95
  Bottom 0.813: v110,112 v108.75,112 107.5,110.75 107.5,107.5 105.72,105.72 U1.23
LEDDP  (via drill 0.6)  (1 unrouted)
  Top 0.813: LED57.A LED58.A LED59.A LED60.A LED61.A | LED61.A LED62.A LED63.A 187.2,10.95 187.5,11.25 | v108.75,12.5 v107.5,12.5 106.25,11.25 106.55,10.95 LED61.A
  Bottom 0.813: U1.22 104.44,103.06 105,102.5 112.5,102.5 113.75,101.25 113.75,13.75 112.5,12.5 v108.75,12.5 v107.5,12.5
LEDE  (via drill 0.6)
  Top 0.813: LED33.A LED34.A LED35.A LED36.A 101.25,85.95 | 101.25,85.95 LED37.A LED38.A LED39.A LED40.A | v105,107.5 v103.75,107.5 102.5,106.25 102.5,87.2 101.25,85.95
  Bottom 0.813: v105,107.5 v103.75,107.5 103.17,106.92 U1.21
LEDF  (via drill 0.6)
  Top 0.813: LED41.A LED42.A LED43.A LED44.A 93.75,60.95 | 93.75,60.95 LED45.A LED46.A LED47.A LED48.A | v91.25,62.5 v92.5,62.5 93.75,61.25 93.75,60.95
  Bottom 0.813: v92.5,62.5 v91.25,62.5 90,63.75 90,101.25 91.25,102.5 95,102.5 95.56,103.06 U1.15
LEDG  (via drill 0.6)
  Top 0.813: LED49.A LED50.A LED51.A LED52.A 98.75,35.95 | LED56.A LED55.A LED54.A LED53.A 98.75,35.95 | v96.25,37.5 v97.5,37.5 98.75,36.25 98.75,35.95
  Bottom 0.813: U1.17 98.09,101.84 97.5,101.25 92.5,101.25 91.25,100 91.25,65 92.5,63.75 93.75,63.75 95,62.5 95,38.75 v96.25,37.5 v97.5,37.5
LOAD  (via drill 0.5)
  Top 0.254: JP2.10 1.27,98.27 7,104 7,124 7.5,124.5 120.5,124.5 v121,124 121.5,123.5 191.5,123.5 192,123 192,104.24 JP4.7 | v95,97.5 95.5,97.5 96.5,98.5 96.5,109 97,109.5 120.5,109.5 v121,109
  Bottom 0.254: v121,124 v121,109 121,7.5 120.5,7 107.5,7 105,4.5 98,4.5 97.5,4 97.5,1.49 JP3.7 | U1.12 93.02,97.02 93.5,97.5 v95,97.5
N$3  (1 unrouted)
  Top 0.254: 196,179 U$2.P$1 194.5,181 197.5,181 JP1.1
  Bottom 0.254: R2.2 198.35,184.35 198,184 JP1.1
N$7
  Bottom 0.813: U1.18 99.36,109.78 R1.1 99.15,112.1 TP2.TP
N$13
  Bottom 0.254: U2.6 196.6,187.55 R2.1 197,187.85 C7.1
P
  Bottom 0.254: SJ5.2 170.5,175 171,174.5 | 171,174.5 171,170.5 | 171,170.5 171,164.5 | 171,164.5 171,160.5 170.5,160 SJ8.2 | SJ7.2 170.5,165 171,164.5 | SJ6.2 170.5,170 171,170.5 | 171,174.5 171,181 171.5,181.5 171.5,189 172,189.5 191.15,189.5 U2.3
P1  (via drill 0.5)
  Top 0.254: JP2.4 1.27,113.27 4,116 4,127 4.5,127.5 126.5,127.5 v127,127 127.5,126.5 194.5,126.5 195,126 195,116.48 JP4.13
  Bottom 0.254: JP3.13 113,3.5 113.5,4 123.5,4 127,7.5 v127,127 127,174.5 127.5,175 SJ5.1
P2  (via drill 0.5)
  Top 0.254: JP2.3 1.27,115.77 3.5,118 3.5,127.5 4,128 127.5,128 v128,127.5 128.5,127 195,127 195.5,126.5 195.5,118.52 JP4.14
  Bottom 0.254: JP3.14 115.5,1.29 115.5,3 116,3.5 124,3.5 128,7.5 v128,127.5 128,169.5 128.5,170 SJ6.1
P3  (via drill 0.5)
  Top 0.254: JP2.2 1.27,118.27 3,120 3,128 3.5,128.5 128.5,128.5 v129,128 129.5,127.5 195.5,127.5 196,127 196,120.56 JP4.15
  Bottom 0.254: JP3.15 118,1.33 118,2.5 118.5,3 124.5,3 129,7.5 v129,128 129,164.5 129.5,165 SJ7.1
P4  (via drill 0.5)
  Top 0.254: JP2.1 1.63,120.63 2.5,121.5 2.5,128.5 3,129 129.5,129 v130,128.5 130.5,128 196,128 196.5,127.5 196.5,122.6 196.6,122.5 196.8,122.3 JP4.16
  Bottom 0.254: JP3.16 120.5,1.37 120.5,2 121,2.5 125,2.5 130,7.5 v130,128.5 130,159.5 130.5,160 SJ8.1
T  (via drill 0.6)
  Top 0.254: v175,190.5 v178,187.5
  Bottom 0.254: SJ9.2 170.5,196.5 171,196 171,192 | 171,192 171,190 | 171,186 171,182 170.5,181.5 SJ12.2 | SJ11.2 170.5,186.5 171,186 | SJ10.2 170.5,191.5 171,192 | 191.5,187.5 191.25,187.5 U2.1 191.15,187.5 v178,187.5 | 171,186 171,190 | 171,190 171.5,190.5 v175,190.5
T1  (via drill 0.5)
  Top 0.254: JP2.8 1.27,103.27 6,108 6,125 6.5,125.5 122.5,125.5 v123,125 123.5,124.5 192.5,124.5 193,124 193,108.32 JP4.9
  Bottom 0.254: JP3.9 102.5,1.59 102.5,3 103,3.5 106,3.5 108.5,6 121.5,6 123,7.5 v123,125 123,196 123.5,196.5 SJ9.1
T2  (via drill 0.5)
  Top 0.254: JP2.7 1.27,105.77 5.5,110 5.5,125.5 6,126 123.5,126 v124,125.5 124.5,125 193,125 193.5,124.5 193.5,110.36 JP4.10
  Bottom 0.254: JP3.10 105,1.63 105,2.5 105.5,3 106.5,3 109,5.5 122,5.5 124,7.5 v124,125.5 124,191 124.5,191.5 SJ10.1
T3  (via drill 0.5)
  Top 0.254: JP2.6 1.27,108.27 5,112 5,126 5.5,126.5 124.5,126.5 v125,126 125.5,125.5 193.5,125.5 194,125 194,112.4 JP4.11
  Bottom 0.254: JP3.11 107.5,1.67 107.5,3 109.5,5 122.5,5 125,7.5 v125,126 125,186 125.5,186.5 SJ11.1
T4  (via drill 0.5)
  Top 0.254: JP2.5 1.27,110.77 4.5,114 4.5,126.5 5,127 125.5,127 v126,126.5 126.5,126 194,126 194.5,125.5 194.5,114.44 JP4.12
  Bottom 0.254: JP3.12 110.5,1.29 110.5,4 111,4.5 123,4.5 126,7.5 v126,126.5 126,181 126.5,181.5 SJ12.1
VCC
  Bottom 0.254: TP1.TP 102.5,197.5 103.5,198.5 187.5,198.5 188,198 188,197.05 C3.1 190.95,197.05 191.5,196.5 191.5,195.55 C4.1 194.5,194.5 195,194 195,189 194.5,188.5 U2.5 | C2.1 107.2,88.5 | 107.2,88.5
  Bottom 0.813: TP1.TP 100.85,112.1 R1.2 100.64,109.78 U1.19 100.64,101.86 101.25,101.25 108.75,101.25 110,100 110,91.75 109.25,91 C1.1
  Bottom 1.016: SJ4.2 104.98,13.77 102.5,16.25 | 102.5,16.25 96.25,16.25 | 96.25,16.25 95,16.25 | 95,16.25 88.73,16.25 SJ1.2 | SJ2.2 92.52,13.77 95,16.25 | SJ3.2 98.73,13.77 96.25,16.25 | 102.5,16.25 107.2,20.95 107.2,88.5 C1.1
VCC1  (via drill 0.6)
  Top 1.016: v73.75,2.5 v72.5,2.5 80,2.5 81.25,3.75 83.81,3.75 85.06,2.5 JP3.2 | JP4.2 186.96,73.5 14,73.5 2.43,85.07 JP2.15
  Bottom 1.016: JP2.15 2.43,85.07 3.75,83.75 3.75,81.25 2.5,80 2.5,12.5 12.5,2.5 v72.5,2.5 v73.75,2.5 | JP3.2 85.06,8.81 86.25,10 SJ1.1
VCC2  (via drill 0.6)
  Top 1.016: v73.75,3.75 v72.5,3.75 78.75,3.75 80,5 85.1,5 87.6,2.5 JP3.3 | JP4.3 185.92,75 15,75 2.39,87.61 JP2.14
  Bottom 1.016: JP2.14 2.39,87.61 5,85 5,80 3.75,78.75 3.75,13.75 13.75,3.75 v72.5,3.75 v73.75,3.75 | JP3.3 87.6,7.6 88.75,8.75 91.25,8.75 92.5,10 SJ2.1
VCC3  (via drill 0.6)
  Top 1.016: v72.5,5 v73.75,5 77.5,5 78.75,6.25 86.25,6.25 90,2.5 90,1.39 JP3.4 | JP4.4 184.88,76.5 16,76.5 2.35,90.15 JP2.13
  Bottom 1.016: JP2.13 2.35,90.15 6.25,86.25 6.25,78.75 5,77.5 5,15 15,5 v72.5,5 v73.75,5 | JP3.4 90.14,6.39 91.25,7.5 97.5,7.5 98.75,8.75 SJ3.1
VCC4  (via drill 0.6)
  Top 1.016: v72.5,6.25 v73.75,6.25 76.25,6.25 77.5,7.5 87.5,7.5 92.5,2.5 92.5,1.43 JP3.5 | JP4.5 183.84,78 17,78 2.31,92.69 JP2.12
  Bottom 1.016: JP2.12 2.31,92.69 7.5,87.5 7.5,77.5 6.25,76.25 6.25,16.25 16.25,6.25 v72.5,6.25 v73.75,6.25 | JP3.5 92.68,5.18 93.75,6.25 103.75,6.25 105,7.5 SJ4.1

### Text on the board
tNames: Wordclock LED board - revision 1 - november 2013 - Wouter Devinck
bNames: Wordclock LED board - revision 1 - november 2013 - Wouter Devinck